# Altium schematic sheet EFUSE_AND_REGULATOR.SchDoc
size 420 x 297 mm; SheetNumber: 3; SheetTotal: 6
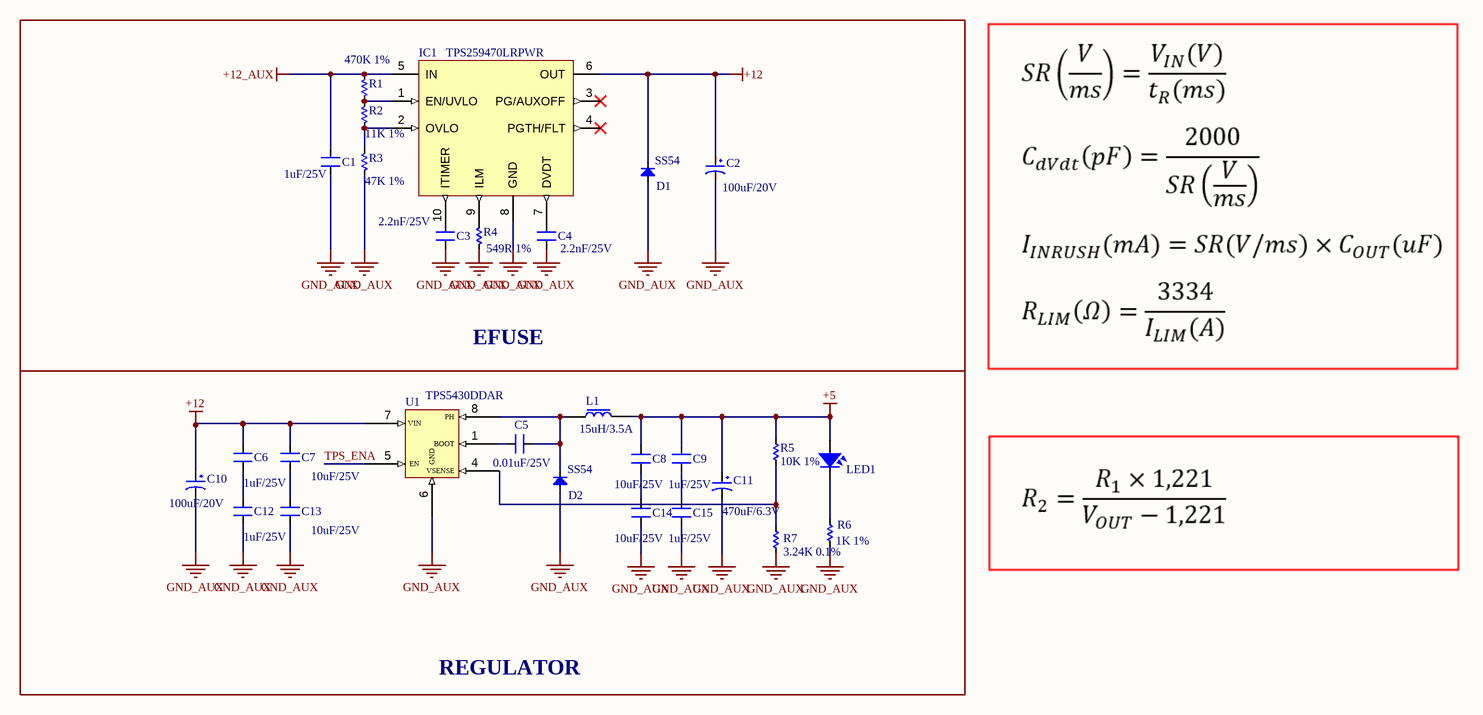
[diagram p0: EFUSE_AND_REGULATOR.SchDoc]

## Parts
C1  1uF/25V  [SM-0603]
C2  100uF/20V  [tu tantalum smd7343]
C3  2.2nF/25V  [SM-0603]
C4  2.2nF/25V  [SM-0603]
C5  0.01uF/25V  [SM-0603]
C6  1uF/25V  [SM-0603]
C7  10uF/25V  [SM-0603]
C8  10uF/25V  [SM-0603]
C9  1uF/25V  [SM-0603]
C10  100uF/20V  [tu tantalum smd7343]
C11  470uF/6.3V  [tu tantalum smd7343]
C12  1uF/25V  [SM-0603]
C13  10uF/25V  [SM-0603]
C14  10uF/25V  [SM-0603]
C15  1uF/25V  [SM-0603]
D1  SS54  [DIO-SMD-A]
D2  SS54  [DIO-SMD-A]
IC1  TPS259470LRPWR  [TPS259470]
L1  15uH/3.5A  [SRP7050TA]
LED1  LED  [REDLED_0603]  (value not drawn)
R1  470K 1%  [RES-SMD-0603]
R2  11K 1%  [RES-SMD-0603]
R3  47K 1%  [RES-SMD-0603]
R4  549R 1%  [RES-SMD-0603]
R5  10K 1%  [RES-SMD-0603]
R6  1K 1%  [RES-SMD-0603]
R7  3.24K 0.1%  [RES-SMD-0603]
U1  TPS5430DDAR  [HSOP8]

## Blocks framed on the sheet
EFUSE: C1-C4 D1 IC1 R1-R4
REGULATOR: C5-C15 D2 L1 LED1 R5-R7 U1

## Nets
+5: C8.1 C9.1 C11.1 L1.2 LED1.1 R5.2
+12: C2.1 C6.1 C7.1 C10.1 D1.2(K) IC1.6(OUT) U1.7(VIN)
+12_AUX: C1.2 IC1.5(IN) R1.2
GND_AUX: C1.1 C2.2 C3.1 C4.1 C10.2 C11.2 C12.2 C13.2 C14.2 C15.2 D1.1(A) D2.1(A) IC1.8(GND) R3.1 R4.1 R6.2 R7.1 U1.6(GND)
TPS_ENA: U1.5(EN)
NetC3_2: C3.2 IC1.10(ITIMER)
NetC4_2: C4.2 IC1.7(DVDT)
NetC5_1: C5.1 D2.2(K) L1.1 U1.8(PH)
NetC5_2: C5.2 U1.1(BOOT)
NetC6_2: C6.2 C12.1
NetC7_2: C7.2 C13.1
NetC8_2: C8.2 C14.1
NetC9_2: C9.2 C15.1
NetIC1_1: IC1.1(EN/UVLO) R1.1 R2.2
NetIC1_2: IC1.2(OVLO) R2.1 R3.2
NetIC1_9: IC1.9(ILM) R4.2
NetLED1_2: LED1.2 R6.1
NetR5_1: R5.1 R7.2 U1.4(VSENSE)

Not connected (* = marked no-connect by the designer): IC1 3(PG/AUXOFF)* 4(PGTH/FLT)*

## Notes on the sheet
- Project:
- BEE-PC1
- Sub-system:
- Design by:
- Hung Nguyen D.
- Bao Bui Q.
- Sheet title:
- Sheet
- A3
- of
- Checked by:
- Approved by:
- Vu Pham
- Revision:
- Document No:
- V1.0.0
- Size:
- Date:

## Library data of the parts
C1 C3-C9 C12-C15 = CM: 0603; Value: 103
C2 C10 = Tu tantalum 100uF 25V SMD7343: TAJD107K020RNJ; Chung_Loai: Dán; Don_Vi: Con; So_Chan: 2; Ten_Linh_Kien: Tụ tantalum 107E-100uF 25V SMD7343; Ma_Hang: MH002347; Kieu_Chan: *
C11 = Tu tantalum 100uF 25V SMD7343: TAJD477K006RNJ; Chung_Loai: Dán; Don_Vi: Con; So_Chan: 2; Ten_Linh_Kien: Tụ tantalum 107E-100uF 25V SMD7343; Ma_Hang: MH002347; Kieu_Chan: *
D1 D2 = Diode SMD: DIODE SCHOTTKY 40V 5A SMA; Code - JEDEC: DO-214-AB; Value: 1N5007; Published: 8-Jun-2000; Revision: July-2002: Re-released for DXP Platform.; Publisher: Altium Limited
IC1 = TPS259470: P/N: TPS259470LRPWR
L1 = INDUCTOR: SRP7050TA-150M
LED1 = LED SMD: Value: LED 3 - 5 ly 2 Colour
R1-R6 = Res-SMD: 0603; Manufacturer: Generic Components; Class: Passive; Published: 08/06/2000; Publisher: Altium Hobart Technology Centre
R7 = Res-SMD: ERA-3AEB3241V; Manufacturer: Generic Components; Class: Passive; Published: 08/06/2000; Publisher: Altium Hobart Technology Centre
U1 = TPS543X: 8SOP; pin to pad: 6>6+9